# Altium schematic sheet DRVR_CIRCUIT.SchDoc
size A
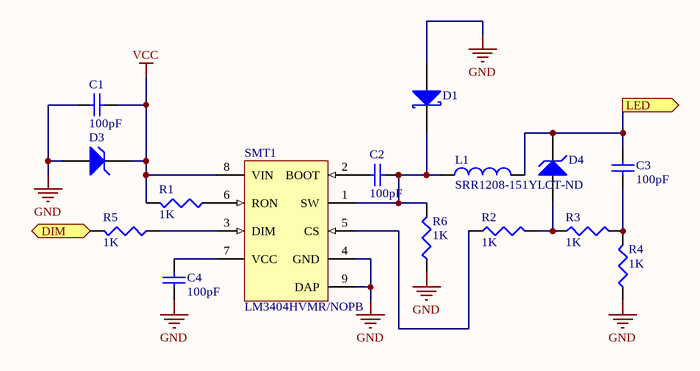
[diagram p0: DRVR_CIRCUIT.SchDoc]

## Parts
C1  value 100pF  [C1206]  (hidden comment: Cap Semi)
C2  value 100pF  [1608[0603]]  (hidden comment: Cap Semi)
C3  value 100pF  [C1206]  (hidden comment: Cap Semi)
C4  value 100pF  [1608[0603]]  (hidden comment: Cap Semi)
D1  D Schottky  [SMB]  (value not drawn)
D3  D Zener  [SMB]  (value not drawn)
D4  D Zener  [SMB]  (value not drawn)
L1  SRR1208-151YLCT-ND  [SRR1208-151YLCT-ND]
R1  value 1K  [J1-0603]  (hidden comment: Res3)
R2  value 1K  [J1-0603]  (hidden comment: Res3)
R3  value 1K  [J1-0603]  (hidden comment: Res3)
R4  value 1K  [J1-0603]  (hidden comment: Res3)
R5  value 1K  [J1-0603]  (hidden comment: Res3)
R6  value 1K  [J1-0603]  (hidden comment: Res3)
SMT1  LM3404HVMR/NOPB  [MRA08B_M]

## Ports
DIM (in), LED (out)

## Nets
GND: C1.1 C4.1 D1.1(A) D3.1(A) R4.1 R6.1 SMT1.4(GND) SMT1.9(DAP)
VCC: C1.2 D3.2(K) R1.2 SMT1.8(VIN)
DIM: R5.2 ; port DIM
LED: C3.2 D4.2(K) L1.2 ; port LED
NetC2_1: C2.1 SMT1.2(BOOT)
NetC2_2: C2.2 D1.2(K) L1.1 R6.2 SMT1.1(SW)
NetC3_1: C3.1 R3.2 R4.2
NetC4_2: C4.2 SMT1.7(VCC)
NetD4_1: D4.1(A) R2.2 R3.1
NetR1_1: R1.1 SMT1.6(RON)
NetR2_1: R2.1 SMT1.5(CS)
NetR5_1: R5.1 SMT1.3(DIM)

## Library data of the parts
C1-C4 = Cap Semi: Capacitor (Semiconductor SIM Model); Published: 8-Jun-2000; LatestRevisionDate: 29-May-2009; LatestRevisionNote: IPC-7351 Footprint Added.; PackageReference: C1206; Publisher: Altium Limited; PackageDescription: Chip Capacitor
D1 = D Schottky: Schottky Diode; Published: 8-Jun-2000; LatestRevisionDate: 17-Jul-2002; LatestRevisionNote: Re-released for DXP Platform.; PackageReference: SMB; Publisher: Altium Limited; PackageDescription: DO-214-AA/SMB; 2 C-Bend Leads; Body 5.3 x 3.6 mm, inc. leads (LxW); Code_JEDEC: DO-214-AA
D3 D4 = D Zener: Zener Diode; Published: 8-Jun-2000; LatestRevisionDate: 17-Jul-2002; LatestRevisionNote: Re-released for DXP Platform.; PackageReference: DIODE-0.7; Publisher: Altium Limited; PackageDescription: Diode, Thru-Hole; 2 Leads; 0.7 in Pin Spacing
R1-R6 = Res3: Resistor; Published: 8-Jun-2000; LatestRevisionDate: 29-May-2009; LatestRevisionNote: IPC-7351 Footprint Added.; PackageReference: J1-0603; Publisher: Altium Limited; PackageDescription: Chip Resistor
SMT1 = LM3404HVMR/NOPB: 1.0A Constant Current Buck Regulator for High Power LED Drivers, 8-pin PSOP, Pb-Free; Manufacturer: National Semiconductor; PackageTopMarking: NSXYTT*L3404*HVMR; PowerWise: Y; CompType: MiscPower; Published: 1-Mar-2010; DatasheetVersion: Jun-2007; PackageVersion: revB, Dec-2007; PackageReference: MRA08B; Publisher: Altium Limited; PackageDescription: Molded, PSOP .193 x .154 x .058in, 8 Lead, .050in Pitch, Large DAP; Supplier 1: Digi-Key; Supplier Part Number 1: LM3404HVMR-ND; Supplier 2: Farnell; Supplier Part Number 2: 1364354; PartNumber: LM3404HVMR/NOPB; RoHS: Y; PinCount: 8; Code_JEDEC: MS-012-AA; ComponentLink1Description: LM3404HV Datasheet; ComponentLink1URL: http://www.national.com/ds/LM/LM3404HV.pdf; ComponentLink2Description: LM3404HV Web Page; ComponentLink2URL: http://www.national.com/pf/LM/LM3404HV.html; ComponentLink3Description: MRA08B Package Page; ComponentLink3URL: http://www.national.com/packaging/folders/mra08b.html